# EAGLE schematic ATTinyX4 (EAGLE 6.3)
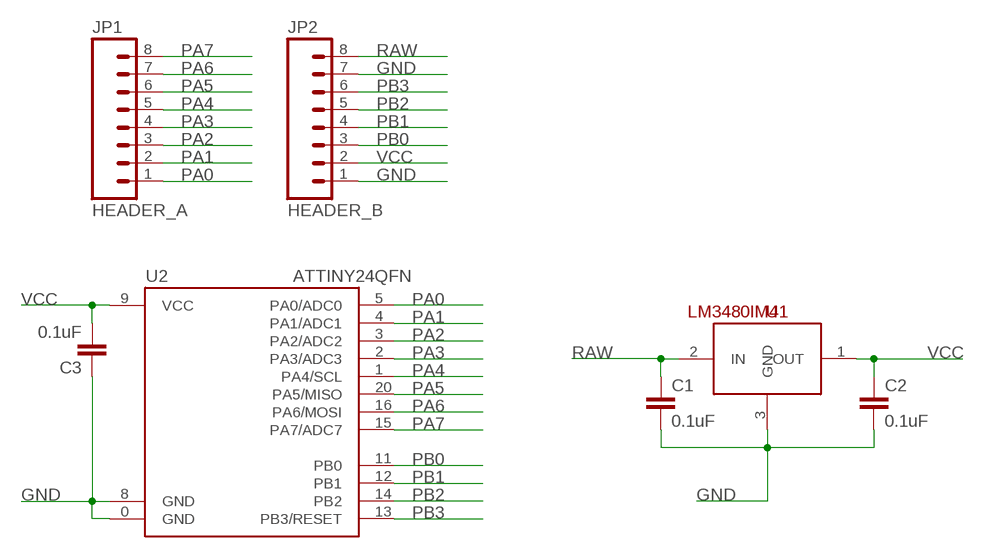
[diagram p0: schematic, sheet 1]

## Parts
C1  0.1uF  CAP0603-CAP  [0603-CAP]
C2  0.1uF  CAP0603-CAP  [0603-CAP]
C3  0.1uF  CAP0603-CAP  [0603-CAP]
JP1  HEADER_A  M081X08  [1X08]
JP2  HEADER_B  M081X08  [1X08]
U1  LM3480IM4  [SOT23-3]
U2  ATTINY24QFN  [QFN20]

## Nets
GND: C1.2 C2.2 C3.1 JP2.1 JP2.7 U1.3(GND) U2.0(GND) U2.8(GND)
PA0: JP1.1 U2.5(PA0/ADC0)
PA1: JP1.2 U2.4(PA1/ADC1)
PA2: JP1.3 U2.3(PA2/ADC2)
PA3: JP1.4 U2.2(PA3/ADC3)
PA4: JP1.5 U2.1(PA4/SCL)
PA5: JP1.6 U2.20(PA5/MISO)
PA6: JP1.7 U2.16(PA6/MOSI)
PA7: JP1.8 U2.15(PA7/ADC7)
PB0: JP2.3 U2.11(PB0)
PB1: JP2.4 U2.12(PB1)
PB2: JP2.5 U2.14(PB2)
PB3: JP2.6 U2.13(PB3/RESET)
RAW: C1.1 JP2.8 U1.2(IN)
VCC: C2.1 C3.2 JP2.2 U1.1(OUT) U2.9(VCC)

## Library data of the parts
C1-C3 = SparkFun-Capacitors:CAP: Capacitor Standard 0603 ceramic capacitor, and 0.1" leaded capacitor.
JP1 JP2 = SparkFun-Connectors:M08: Header 8 Standard 8-pin 0.1" header. Use with straight break away headers (SKU : PRT-00116), right angle break away headers (PRT-00553), swiss pins (PRT-00743), machine pins (PRT-00117), and female headers (PRT-00115).
U1 = SparkFun-PowerIC:LM3480IM4: Small package linear regulator
U2 = SparkFun-DigitalIC:ATTINY24: Atmel 20-pin 2kB flash uC